# Altium schematic sheet cm_filter_ch1_b.SchDoc: Common Mode Filter CH1 B
size A4; Date: 2015-02-21; Author: Piotr Kuligowski; Revision: 1-0; SheetTotal: 14; Model: EM1
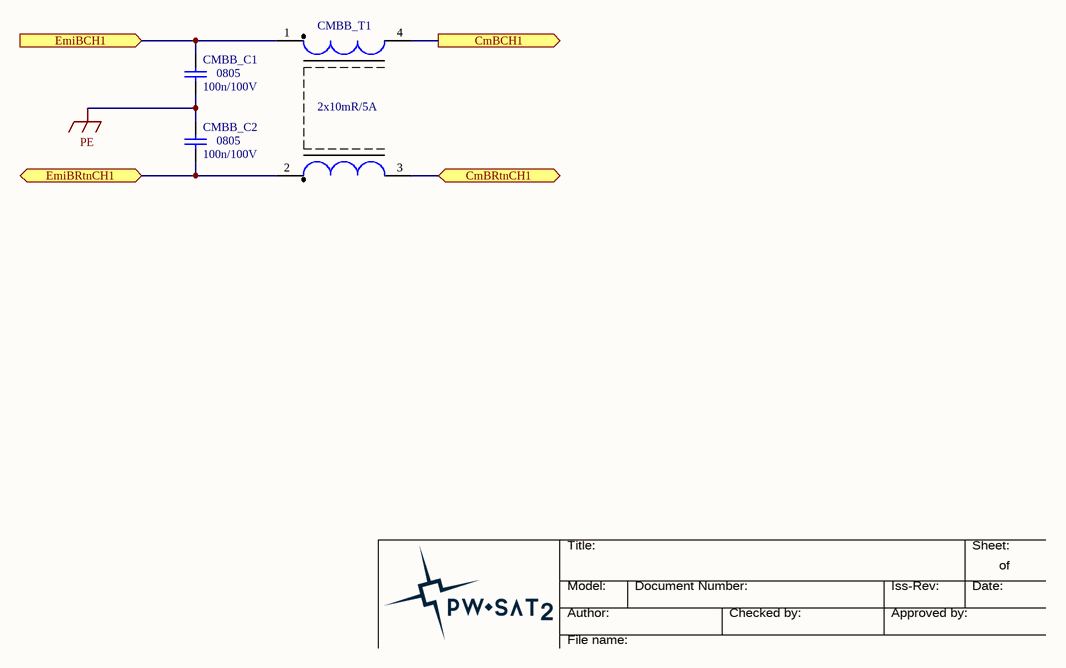
[diagram p0: cm_filter_ch1_b.SchDoc]

## Parts
CMBB_C1  Package: 0805  [SMD_Capacitor_0805]  (hidden comment: 100n/100V)
CMBB_C2  Package: 0805  [SMD_Capacitor_0805]  (hidden comment: 100n/100V)
CMBB_T1  2x10mR/5A  [TDK_ACM7060]

## Ports
CmBCH1 (out), CmBRtnCH1, EmiBCH1 (in), EmiBRtnCH1

## Nets
PE: CMBB_C1.2 CMBB_C2.1
CmBCH1: CMBB_T1.4 ; port CmBCH1
CmBRtnCH1: CMBB_T1.3 ; port CmBRtnCH1
EmiBCH1: CMBB_C1.1 CMBB_T1.1 ; port EmiBCH1
EmiBRtnCH1: CMBB_C2.2 CMBB_T1.2 ; port EmiBRtnCH1

## Notes on the sheet
- Title:
- Sheet:
- of
- Author:
- Model:
- Document Number:
- Checked by:
- Iss-Rev:
- Approved by:
- Date:
- File name:

## Library data of the parts
CMBB_C1 CMBB_C2 = Cer_C0805T104K1RCLTU: Ceramic Cap Kemet COTS 100n/100V X7R 0805; ManufacturerPartNumber: C0805T104K1RCLTU; Manufacturer: Kemet; Value: 100n/100V
CMBB_T1 = ACM7060-301-2PL-TL01: TDK ACM7060-301 Common Mode Choke; Manufacturer: TDK; ManufacturerPartNumber: ACM7060-301-2PL-TL01; Value: 2x10mR/5A